# Altium project Poc_20230606.PrjPcb
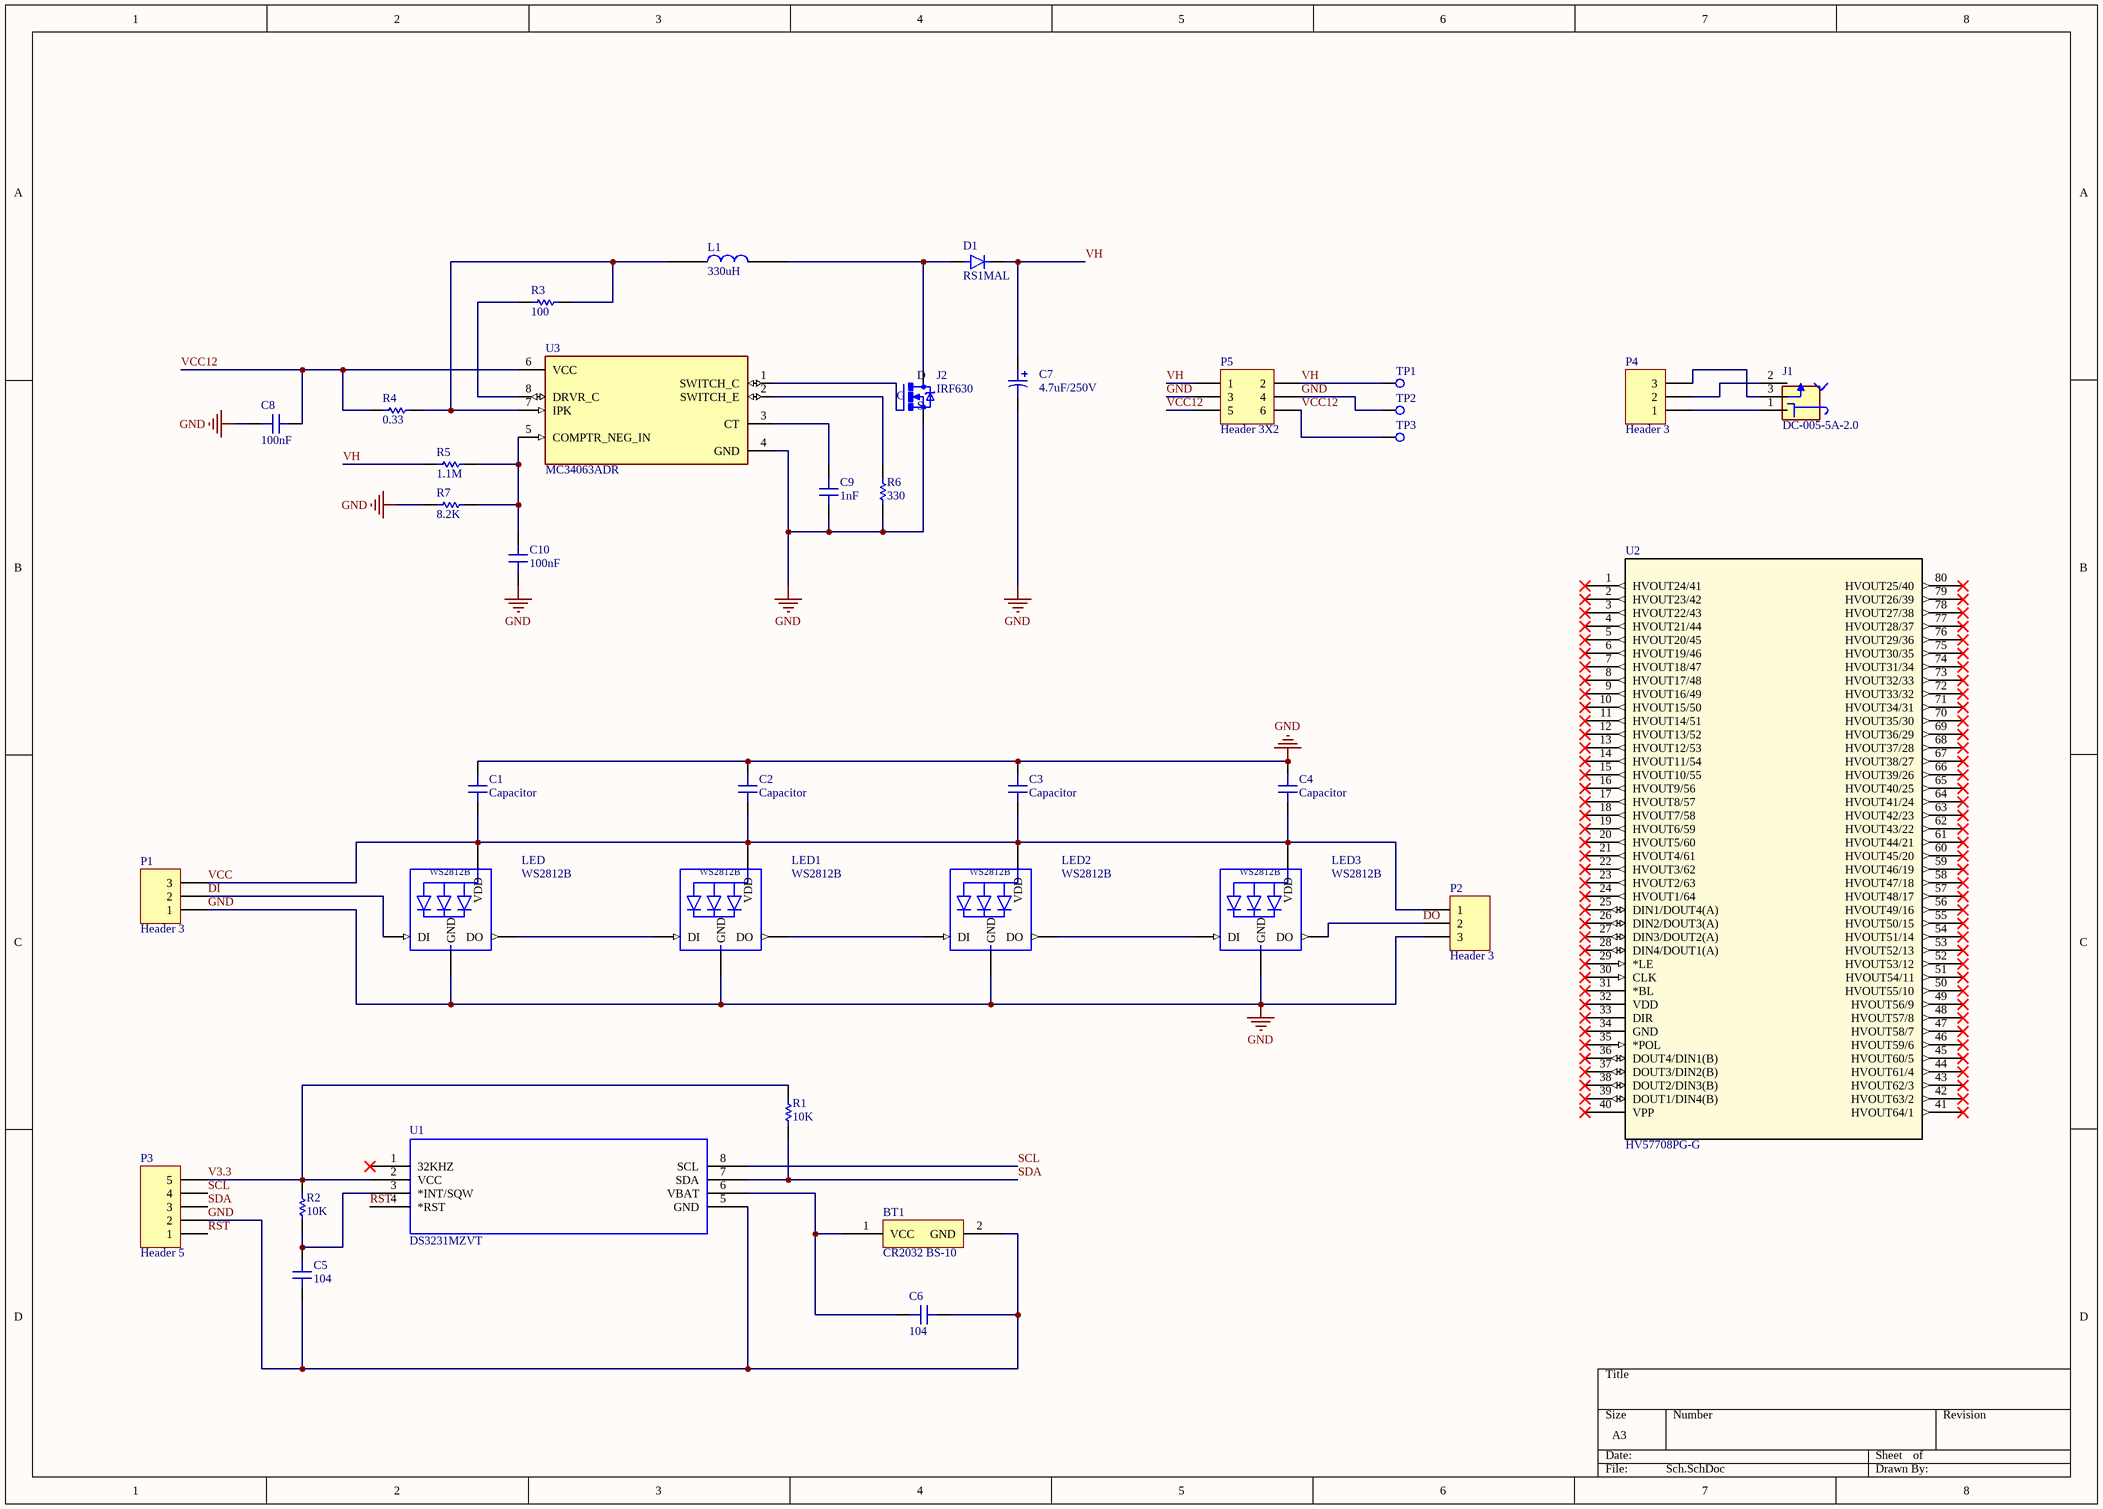
[diagram p0: Sch.SchDoc]
1 sheet, 37 parts. Net scope: global (net labels, ports and power ports of the same name join across sheets).
Board file: Pcb.PcbDoc

## Sheet Sch.SchDoc
size A3

### Parts
BT1  CR2032 BS-10  [CR2032 BS-10]
C1  Capacitor  [0402]
C2  Capacitor  [0402]
C3  Capacitor  [0402]
C4  Capacitor  [0402]
C5  104  [0805]
C6  104  [0805]
C7  4.7uF/250V  [1808 Polarized]
C8  100nF  [0805]
C9  1nF  [0805]
C10  100nF  [0805]
D1  RS1MAL  [SODFL5226X100N]
J1  DC-005-5A-2.0  [XKB_DC-005-5A-2.0]
J2  IRF630  [TO220V]
L1  330uH  [INDP125125X80N]
LED  WS2812B  [WS2812B]
LED1  WS2812B  [WS2812B]
LED2  WS2812B  [WS2812B]
LED3  WS2812B  [WS2812B]
P1  Header 3  [HDR1X3]
P2  Header 3  [HDR1X3]
P3  Header 5  [HDR1X5]
P4  Header 3  [HDR1X3]
P5  Header 3X2  [HDR2X3]
R1  10K  [0805]
R2  10K  [0805]
R3  100  [0805]
R4  0.33  [0805]
R5  1.1M  [0805]
R6  330  [0805]
R7  8.2K  [0805]
TP1  (no value)  [Test-Point-SMD]
TP2  (no value)  [Test-Point-SMD]
TP3  (no value)  [Test-Point-SMD]
U1  DS3231MZVT  [DS3231]
U2  HV57708PG-G  [HV57708]
U3  MC34063ADR  [MC34063ADR]

### Nets
GND: BT1.2(GND) C1.2 C2.2 C3.2 C4.2 C5.1 C6.1 C7.2 C8.2 C9.1 C10.2 J2.3(S) LED.3-GND(GND) LED1.3-GND(GND) LED2.3-GND(GND) LED3.3-GND(GND) P1.1 P2.3 P3.2 P5.3 P5.4 R6.1 R7.1 TP2.1 U1.5(GND) U3.4(GND)
DI: LED.4-DIN(DI) P1.2
DO: LED3.2-DOUT(DO) P2.2
RST: P3.1 U1.4(*RST)
SCL: P3.4 U1.8(SCL)
SDA: P3.3 R1.1 U1.7(SDA)
V3.3: P3.5 R1.2 R2.2 U1.2(VCC)
VCC: C1.1 C2.1 C3.1 C4.1 LED.1-VDD(VDD) LED1.1-VDD(VDD) LED2.1-VDD(VDD) LED3.1-VDD(VDD) P1.3 P2.1
VCC12: C8.1 P5.5 P5.6 R4.1 TP3.1 U3.6(VCC)
VH: C7.1 D1.1(K) P5.1 P5.2 R5.1 TP1.1
NetBT1_1: BT1.1(VCC) C6.2 U1.6(VBAT)
NetC5_2: C5.2 R2.1 U1.3(*INT/SQW)
NetC9_2: C9.2 U3.3(CT)
NetC10_1: C10.1 R5.2 R7.2 U3.5(COMPTR_NEG_IN)
NetD1_2: D1.2(A) J2.2(D) L1.2
NetJ1_1: J1.1 P4.1
NetJ1_2: J1.2 P4.2
NetJ1_3: J1.3 P4.3
NetJ2_1: J2.1(G) U3.1(SWITCH_C)
NetL1_1: L1.1 R3.2 R4.2 U3.7(IPK)
NetLED1_2-DOUT: LED1.2-DOUT(DO) LED2.4-DIN(DI)
NetLED2_2-DOUT: LED2.2-DOUT(DO) LED3.4-DIN(DI)
NetLED_2-DOUT: LED.2-DOUT(DO) LED1.4-DIN(DI)
NetR3_1: R3.1 U3.8(DRVR_C)
NetR6_2: R6.2 U3.2(SWITCH_E)

Not connected (* = marked no-connect by the designer): U1 1(32KHZ)*; U2 1(HVOUT24/41)* 2(HVOUT23/42)* 3(HVOUT22/43)* 4(HVOUT21/44)* 5(HVOUT20/45)* 6(HVOUT19/46)* 7(HVOUT18/47)* 8(HVOUT17/48)* 9(HVOUT16/49)* 10(HVOUT15/50)* 11(HVOUT14/51)* 12(HVOUT13/52)* 13(HVOUT12/53)* 14(HVOUT11/54)* 15(HVOUT10/55)* 16(HVOUT9/56)* 17(HVOUT8/57)* 18(HVOUT7/58)* 19(HVOUT6/59)* 20(HVOUT5/60)* 21(HVOUT4/61)* 22(HVOUT3/62)* 23(HVOUT2/63)* 24(HVOUT1/64)* 25(DIN1/DOUT4(A))* 26(DIN2/DOUT3(A))* 27(DIN3/DOUT2(A))* 28(DIN4/DOUT1(A))* 29(*LE)* 30(CLK)* 31(*BL)* 32(VDD)* 33(DIR)* 34(GND)* 35(*POL)* 36(DOUT4/DIN1(B))* 37(DOUT3/DIN2(B))* 38(DOUT2/DIN3(B))* 39(DOUT1/DIN4(B))* 40(VPP)* 41(HVOUT64/1)* 42(HVOUT63/2)* 43(HVOUT62/3)* 44(HVOUT61/4)* 45(HVOUT60/5)* 46(HVOUT59/6)* 47(HVOUT58/7)* 48(HVOUT57/8)* 49(HVOUT56/9)* 50(HVOUT55/10)* 51(HVOUT54/11)* 52(HVOUT53/12)* 53(HVOUT52/13)* 54(HVOUT51/14)* 55(HVOUT50/15)* 56(HVOUT49/16)* 57(HVOUT48/17)* 58(HVOUT47/18)* 59(HVOUT46/19)* 60(HVOUT45/20)* 61(HVOUT44/21)* 62(HVOUT43/22)* 63(HVOUT42/23)* 64(HVOUT41/24)* 65(HVOUT40/25)* 66(HVOUT39/26)* 67(HVOUT38/27)* 68(HVOUT37/28)* 69(HVOUT36/29)* 70(HVOUT35/30)* 71(HVOUT34/31)* 72(HVOUT33/32)* 73(HVOUT32/33)* 74(HVOUT31/34)* 75(HVOUT30/35)* 76(HVOUT29/36)* 77(HVOUT28/37)* 78(HVOUT27/38)* 79(HVOUT26/39)* 80(HVOUT25/40)*

### Library data of the parts
C5 C6 C8-C10 = Capacitor
C7 = CapacitorPolarized
D1 = RS1MAL: 1A, 200V - 1000V Fast Recovery Surface Mount Rectifier; MF: Taiwan Semiconductor; Package: DO-221AC-2 Taiwan Semiconductor; Price: None; Check_prices: https://www.snapeda.com/parts/RS1MAL/Taiwan+Semiconductor/view-part/?ref=eda; Value: *; SnapEDA_Link: https://www.snapeda.com/parts/RS1MAL/Taiwan+Semiconductor/view-part/?ref=snap; MP: RS1MAL; Availability: In Stock; Purchase-URL: https://pricing.snapeda.com/search?q=RS1MAL&ref=eda
J1 = DC-005-5A-2.0: DC Power Receptacle Jack, Through Holeï¼ŒRight Angle; MF: XKB Industrial Precision; Value: *; SnapEDA_Link: https://www.snapeda.com/parts/DC-005-5A-2.0/XKB+Industrial+Precision/view-part/?ref=snap; Availability: Not in stock; Price: None; Package: Package; Check_prices: https://www.snapeda.com/parts/DC-005-5A-2.0/XKB+Industrial+Precision/view-part/?ref=eda; MP: DC-005-5A-2.0
J2 = IRF630: N-Channel 200 V 9A (Tc) 30W (Tc) Through Hole TO-220FP; MF: STMicroelectronics; Check_prices: https://www.snapeda.com/parts/IRF630/STMicroelectronics/view-part/?ref=eda; Purchase-URL: https://pricing.snapeda.com/search/part/IRF630/?ref=eda; Price: None; SnapEDA_Link: https://www.snapeda.com/parts/IRF630/STMicroelectronics/view-part/?ref=snap; Availability: In Stock; Package: TO-220 Vishay; MP: IRF630; Value: *
L1 = Inductor
LED LED1-LED3 = WS2812B: Raspberry Pi HAT _40 pin_ Wheeled Robotics Kit; MF: SparkFun Electronics; Availability: Unavailable; SnapEDA_Link: https://www.snapeda.com/parts/WS2812B/Worldsemi/view-part/1038297/?ref=snap; MP: WS2812B; Price: None; Value: *; Package: None
P1 P2 P4 = Header 3: Header, 3-Pin; LatestRevisionDate: 17-Jul-2002; LatestRevisionNote: Re-released for DXP Platform.; Publisher: Altium Limited
P3 = Header 5: Header, 5-Pin; LatestRevisionDate: 17-Jul-2002; LatestRevisionNote: Re-released for DXP Platform.; Publisher: Altium Limited
P5 = Header 3X2: Header, 3-Pin, Dual row; LatestRevisionDate: 17-Jul-2002; LatestRevisionNote: Re-released for DXP Platform.; Publisher: Altium Limited
R1-R7 = Resistor
TP1-TP3 = TestPoint
U1 = DS3231MZVT: Real Time Clock _RTC_ IC Clock/Calendar IÂ²C, 2-Wire Serial 8-SOIC _0.154, 3.90mm Width_; MF: Maxim Integrated; MP: DS3231MZ/V+T; Digi-Key_Part_Number: DS3231MZ/V+TTR-ND; Digi-Key_Purchase_URL: https://www.digikey.com/product-detail/en/maxim-integrated/DS3231MZ-V-T/DS3231MZ-V-TTR-ND/3440500?utm_source=snapeda&utm_medium=aggregator&utm_campaign=symbol; SnapEDA_Link: https://www.snapeda.com/parts/DS3231MZ/V+T/Maxim%20Integrated/view-part/230018/?ref=snap; Package: SOIC-8 Maxim Integrated; Value: *
U2 = HV57708PG-G: No Description Available; Mfr_Name: Microchip; RefDes: RefDes; Type: Type
U3 = MC34063ADR: 1.5-A Boost/Buck/Inverting Switching Regulator 8-SOIC 0 to 70; Price: None; Package: None; Availability: Unavailable; MP: MC34063ADR; Value: *